# Altium schematic sheet TPS54540_V2.SchDoc
size A4; SheetNumber: 1; SheetTotal: 1
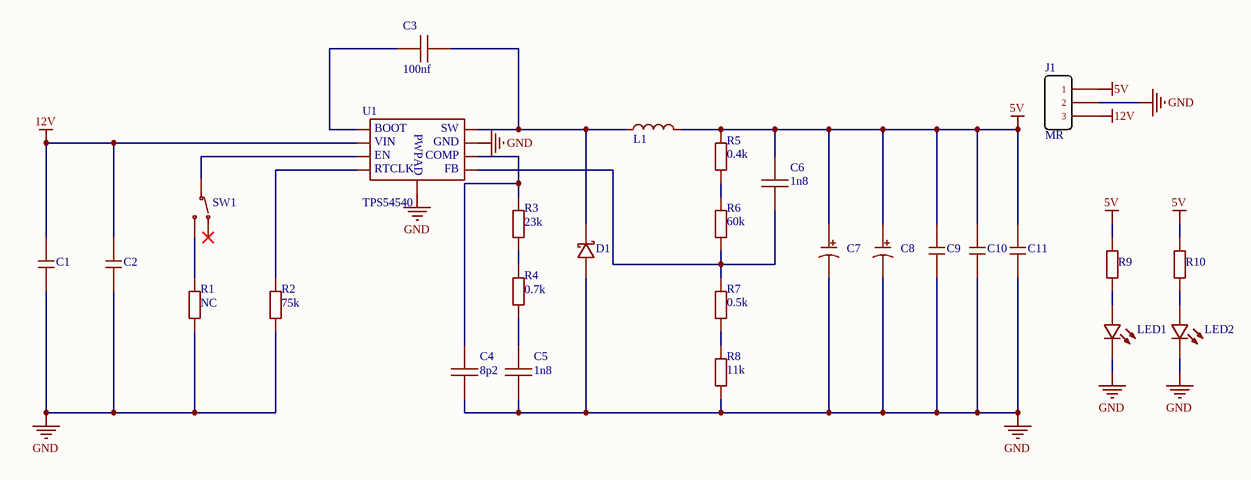
[diagram p0: TPS54540_V2.SchDoc]

## Parts
C1  4u7  [0805C]  (value not drawn)
C2  4u7  [0805C]  (value not drawn)
C3  100nf  [0603C]
C4  8p2  [0603C]
C5  1n8  [0603C]
C6  1n8  [0603C]
C7  47uF  [SVP6.3]  (value not drawn)
C8  47uF  [3528B/1210]  (value not drawn)
C9  22uF  [0805C]  (value not drawn)
C10  22uF  [0805C]  (value not drawn)
C11  NC  [0805C]  (value not drawn)
D1  1054  [TO-277]  (value not drawn)
J1  MR  [MR30-FB]
L1  2u2  [10XXL]  (value not drawn)
LED1  LED  [0603D]  (value not drawn)
LED2  LED  [0603D]  (value not drawn)
R1  NC  [0603R]
R2  75k  [0603R]
R3  23k  [0603R]
R4  0.7k  [0603R]
R5  0.4k  [0603R]
R6  60k  [0603R]
R7  0.5k  [0603R]
R8  11k  [0603R]
R9  4K7  [0603R]  (value not drawn)
R10  4K7  [0603R]  (value not drawn)
SW1  开关  [*SW-1280S]  (value not drawn)
U1  TPS54540  [SOP-8-PP]

## Nets
5V: C6.2 C7.1 C8.1 C9.1 C10.1 C11.1 J1.1 L1.2 R5.2 R9.1 R10.1
12V: C1.2 C2.2 J1.3 U1.2
GND: C1.1 C2.1 C4.2 C5.2 C7.2 C8.2 C9.2 C10.2 C11.2 D1.1 J1.2 LED1.2 LED2.2 R1.1 R2.1 R8.1 U1.7 U1.9
NetC3_1: C3.1 U1.1
NetC3_2: C3.2 D1.2 L1.1 U1.8
NetC4_1: C4.1 R3.2 U1.6
NetC5_1: C5.1 R4.1
NetC6_1: C6.1 R6.1 R7.2 U1.5
NetLED1_1: LED1.1 R9.2
NetLED2_1: LED2.1 R10.2
NetR1_2: R1.2 SW1.3
NetR2_2: R2.2 U1.4
NetR3_1: R3.1 R4.2
NetR5_1: R5.1 R6.2
NetR7_1: R7.1 R8.2
NetSW1_1: SW1.1 U1.3

Not connected (* = marked no-connect by the designer): SW1 2*

## Notes on the sheet
- (in symbol 芯片/IC-TPS54540) BOOT; SW; VIN; GND; PWPAD; EN; COMP; RTCLK; FB

## Library data of the parts
C1-C6 C9-C11 = 电容_贴片
C7 = 电容_贴片电解
C8 = 电容_贴片钽
D1 = 二极管_肖特基
J1 = 接口_MR
L1 = 电感_贴片
LED1 LED2 = 二极管_贴片发光
R1-R10 = 电阻_贴片
SW1 = 开关_三脚
U1 = 芯片/IC-TPS54540